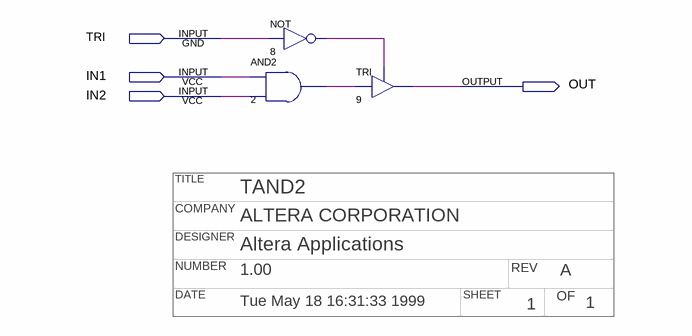
[diagram p0: schematic sheet]
// Quartus schematic tand2.bdf as structural Verilog: 3 symbols, 4 pins
// Title block: TITLE: TAND2; COMPANY: ALTERA CORPORATION; DESIGNER: Altera Applications; NUMBER: 1.00; REV: A; DATE: Tue May 18 16:31:33 1999; SHEET: 1; OF: 1
module tand2 (
  input  TRI,
  input  IN1,
  input  IN2,
  output OUT
);

  wire n2_out, n8_out;

  not u_8 (n8_out, TRI);
  and u_2 (n2_out, IN1, IN2);
  TRI u_9 (.IN(n2_out), .OE(n8_out), .OUT(OUT));
endmodule
